# Altium schematic sheet POWER_GATEWAY.SchDoc
size A4
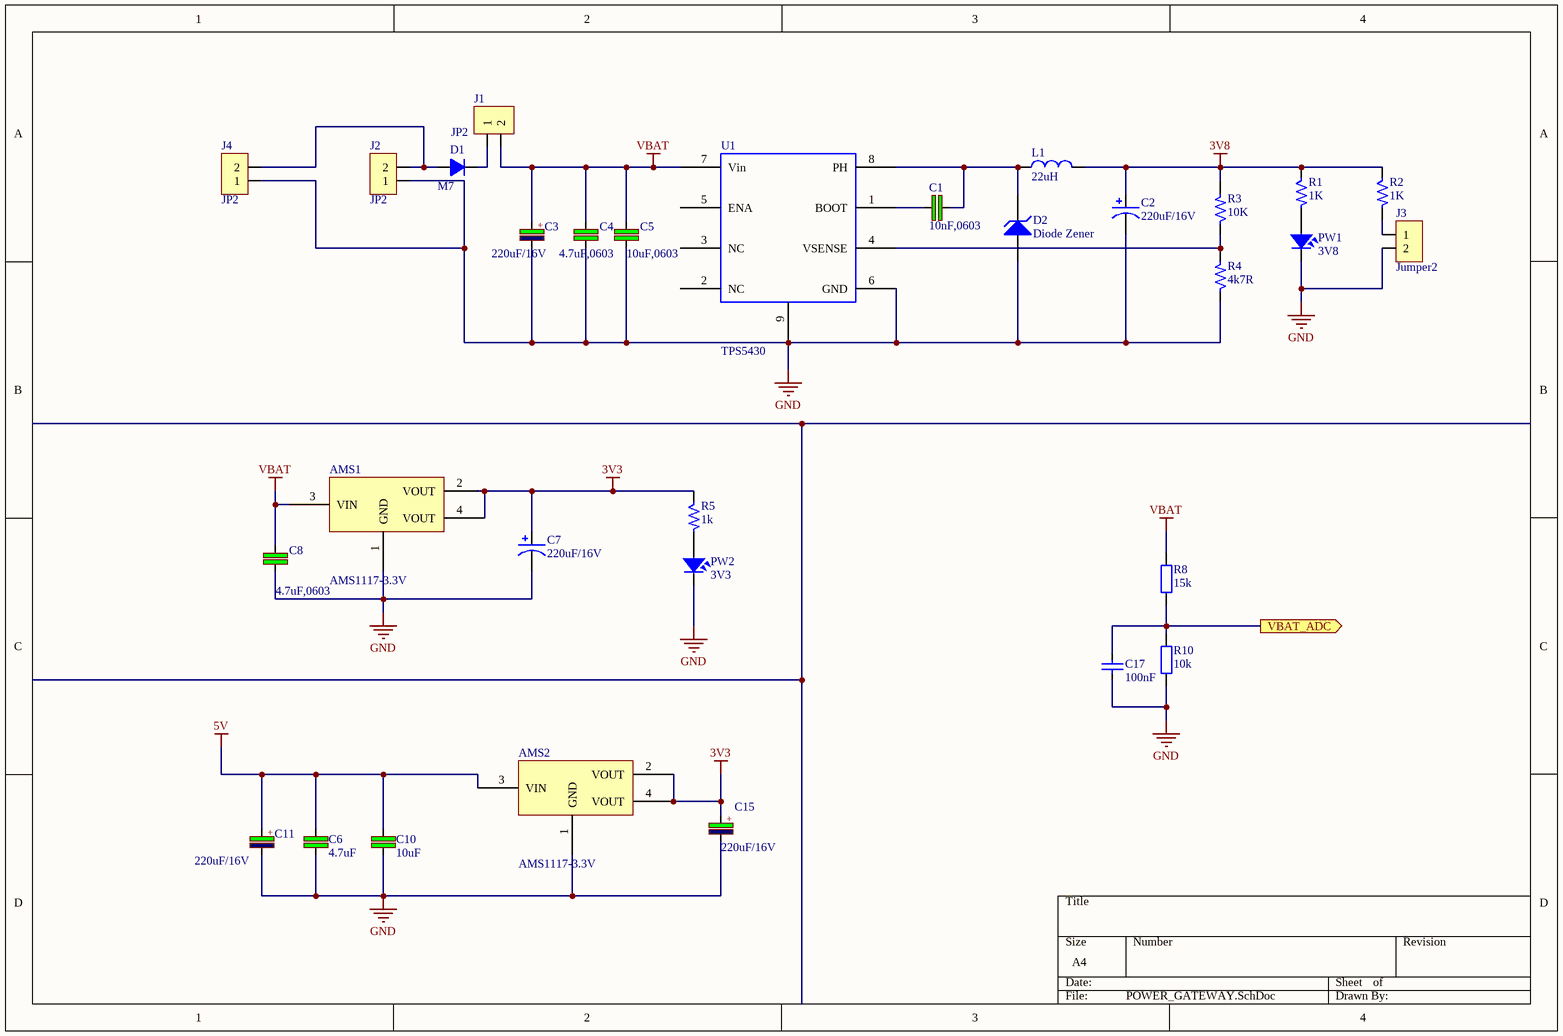
[diagram p0: POWER_GATEWAY.SchDoc]

## Parts
AMS1  AMS1117-3.3V  [SOT223]
AMS2  AMS1117-3.3V  [SOT223]
C1  value 10nF,0603  [CAP_0603]  (hidden comment: 100nF)
C2  220uF/16V  [C5mm]
C3  220uF/16V  [C8mm]
C4  value 4.7uF,0603  [CAP_0603]  (hidden comment: 100nF)
C5  value 10uF,0603  [CAP_0603]  (hidden comment: 100uF)
C6  4.7uF  [CAP_0603]
C7  220uF/16V  [C5mm]
C8  value 4.7uF,0603  [CAP_0603]  (hidden comment: 33pF)
C10  10uF  [CAP_0603]
C11  220uF/16V  [C8mm]
C15  220uF/16V  [C5mm]
C17  100nF  [CAP_0603]
D1  M7  [SMA]
D2  Diode Zener  [SMA]
J1  JP2  [KF2-5.08]
J2  JP2  [KF2-5.08]
J3  Jumper2  [CON2]
J4  JP2  [KF2-5.08]
L1  22uH  [Inductor_SMD]
PW1  3V8  [LED-0805-Blue]
PW2  3V3  [LED-0805-Blue]
R1  1K  [RES-SMD-0805]
R2  1K  [RES-SMD-0805]
R3  10K  [RES-SMD-0603]
R4  4k7R  [RES-SMD-0603]
R5  1k  [RES-SMD-0603]
R8  15k  [RES-SMD-0805]
R10  10k  [RES-SMD-0805]
U1  TPS5430  [TPS5430-2]

## Ports
VBAT_ADC (out)

## Nets
3V3: AMS1.2(VOUT) AMS1.4(VOUT) AMS2.2(VOUT) AMS2.4(VOUT) C7.1 C15.1 R5.1
3V8: C2.1 L1.2 R1.1 R2.1 R3.2
5V: AMS2.3(VIN) C6.1 C10.1 C11.1
GND: AMS1.1(GND) AMS2.1(GND) C2.2 C3.2 C4.1 C5.1 C6.2 C7.2 C8.1 C10.2 C11.2 C15.2 C17.1 D2.1(A) J2.1 J3.2 J4.1 PW1.2 PW2.2 R4.1 R10.1 U1.6(GND) U1.9(PWR_PAD)
VBAT: AMS1.3(VIN) C3.1 C4.2 C5.2 C8.2 J1.2 R8.2 U1.7(Vin)
VBAT_ADC: C17.2 R8.1 R10.2 ; port VBAT_ADC
NetC1_1: C1.1 D2.2(K) L1.1 U1.8(PH)
NetC1_2: C1.2 U1.1(BOOT)
NetD1_1: D1.1(A) J2.2 J4.2
NetD1_2: D1.2(K) J1.1
NetJ3_1: J3.1 R2.2
NetPW1_1: PW1.1 R1.2
NetPW2_1: PW2.1 R5.2
NetR3_1: R3.1 R4.2 U1.4(VSENSE)

Not connected (* = marked no-connect by the designer): U1 2(NC) 3(NC) 5(ENA)

## Notes on the sheet
- (in symbol CP3) +

## Library data of the parts
AMS1 AMS2 = AMS1117 SMD: Dán; Value: AMS1117-3.3V SOT223; Don_Vi: Con; Ma_Hang: MH000596; Ghi_Chu: *; Kieu_Chan: *; Chung_Loai: Dán
C1 C4 C5 C8 = C: 4.7µF ±10% 35V Ceramic Capacitor X5R 0805 (2012 Metric); Manufacturer: Samsung Electro-Mechanics; Part number: CL21A475KLCLQNC; User_Description: CAP CER 4.7UF 35V X5R 0805; Category: CAPACITOR; Package: 0805
C2 C7 = Cap Pol: Polarized Capacitor (Axial); Published: 8-Jun-2000; LatestRevisionDate: 17-Jul-2002; LatestRevisionNote: Re-released for DXP Platform.; PackageReference: POLAR0.8; Publisher: Altium Limited
C3 C11 C15 = CP3: Cap 470uF/63V; Value: Cap 470uF/63V
C6 = C: Cap SMD; Manufacturer: Samsung Electro-Mechanics; Part number: CL21A106KPFNNNG; Value: 10uF; User_Description: CAP CER 10UF 10V X5R 0805; Category: CAPACITOR; Package: 0805
C10 = C: Cap SMD; Manufacturer: Samsung Electro-Mechanics; Part number: CL21A106KPFNNNG; User_Description: CAP CER 10UF 10V X5R 0805; Value: 10uF; Category: CAPACITOR; Package: 0805
C17 = CapSMD: Capacitor; Value: 33p; Published: 8-Jun-2000; LatestRevisionDate: 17-Jul-2002; LatestRevisionNote: Re-released for DXP Platform.; PackageReference: RAD-0.3; Publisher: Altium Limited
D1 = D1A: Diode 1A; Value: 1N4007
D2 = Diode Zener: Zener Diode; Published: 8-Jun-2000; LatestRevisionDate: 17-Jul-2002; LatestRevisionNote: Re-released for DXP Platform.; PackageReference: DIODE-0.7; Publisher: Altium Limited
J1-J4 = JP2: WR-PHD 2.54 mm Angled Socket Header; Manufacturer: W¨¹rth Elektronik eiSos GmbH; partNo: 613002143121; ComponentLink1 Description: Manufacturer; ComponentLink2 Description: Datasheet; NoPins: 02; Created Date: 29 March 2013; ComponentLink1URL: http://www.we-online.com; ComponentLink2URL: http://katalog.we-online.de/em/datasheet/6130xx143121.pdf; Created by: Karrer Zheng
L1 = L1: 22µH Shielded Inductor 1.65A 96mOhm Max Nonstandard; Manufacturer: Bourns Inc.; Part Number: SRR0745A-220M; Value: 220uH; User_Description: FIXED IND 22UH 1.65A 96 MOHM SMD; Category: INDUCTORS; Package: SMD
PW1 PW2 = LED: LED RED DIFFUSED 0805 SMD; Manufacturer: OSRAM Opto Semiconductors Inc.; Part number: LS R976-NR-1; Value: Red; Category: LED SMD; Package: 0805; User_Description: LED RED DIFFUSED 0805 SMD
R1 R2 R5 = R: Resistor 1/4W; Manufacturer: Yageo; Part number: RC0805FR-071KL; User_Description: RES SMD 1K OHM 1% 1/8W 0805; Value: 1k; Category: RESISTORS; Package: 0805
R3 = R: RES SMD 10K OHM 1% 1/8W 0805; Manufacturer: Yageo; Part number: RC0805FR-0710KL; Category: RESISTORS; Package: 0805; User_Description: RES SMD 10K OHM 1% 1/8W 0805; Value: 10k
R4 = R: RES SMD 3.3K OHM 1% 1/8W 0805; Manufacturer: Yageo; Part number: RC0805FR-073K3L; Category: RESISTORS; Package: 0805; User_Description: RES SMD 3.3K OHM 1% 1/8W 0805; Value: 3.3k
R8 R10 = Resistor - SMD: Resistor SMD; Manufacturer: Generic Components; Class: Passive; Published: 08/06/2000; Publisher: Altium Hobart Technology Centre
U1 = TPS5430: Name: TPS5430